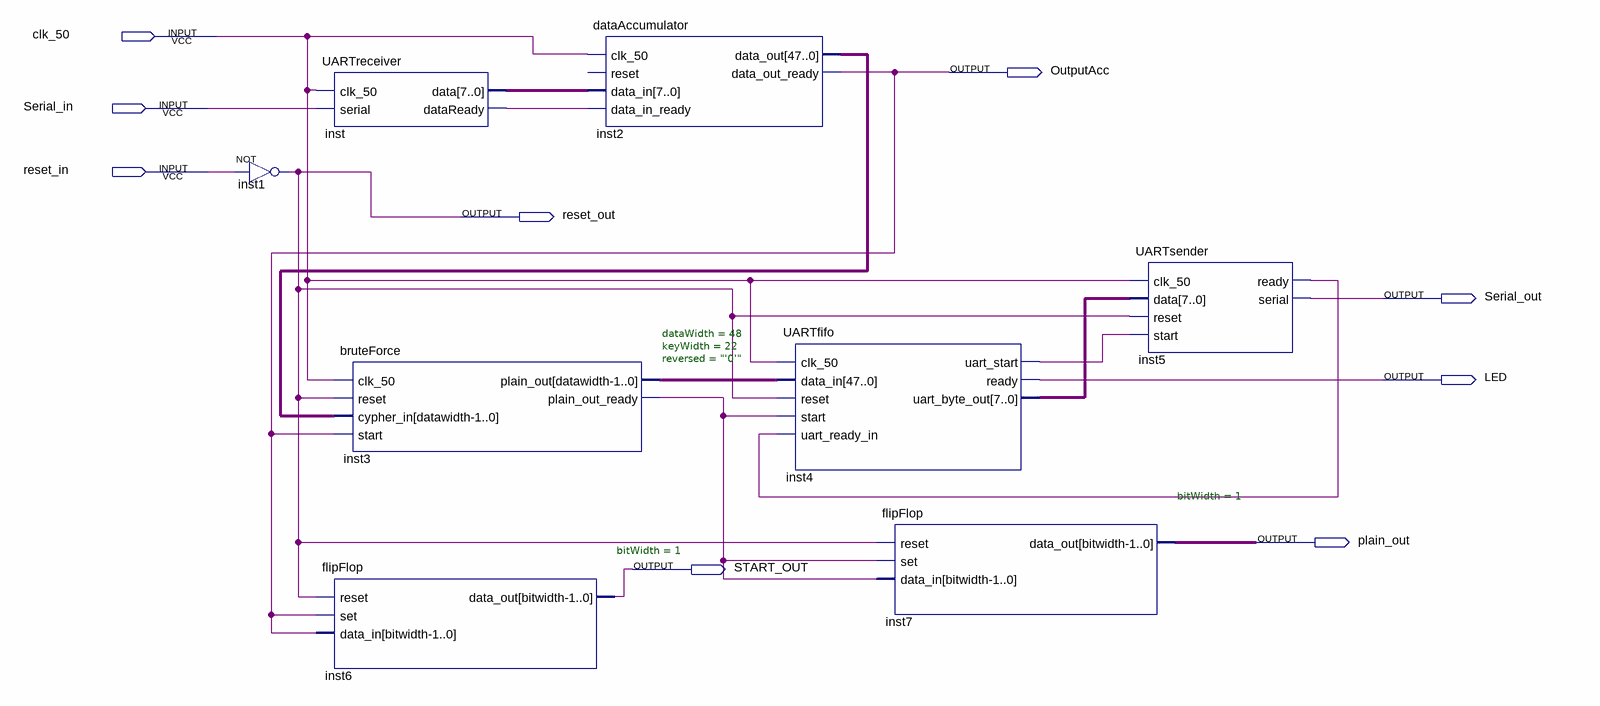
[diagram p0: schematic sheet]
// Quartus schematic bruteForceAttack.bdf as structural Verilog: 8 symbols, 9 pins
module bruteForceAttack (
  input  clk_50,
  input  Serial_in,
  input  reset_in,
  output OutputAcc,
  output reset_out,
  output Serial_out,
  output LED,
  output plain_out,
  output START_OUT
);

  wire inst3_plain_out_ready, inst4_uart_start, inst5_ready, inst_dataready;
  wire [7:0] inst4_uart_byte_out, inst_data;
  wire [47:0] inst2_data_out, inst3_plain_out;

  not inst1 (reset_out, reset_in);
  UARTreceiver inst (.clk_50(clk_50), .serial(Serial_in), .data(inst_data), .dataReady(inst_dataready));
  bruteForce #(.dataWidth(48), .keyWidth(22), .reversed("'0'")) inst3 (
    .clk_50(clk_50), .reset(reset_out), .cypher_in(inst2_data_out), .start(OutputAcc),
    .plain_out(inst3_plain_out), .plain_out_ready(inst3_plain_out_ready));
  flipFlop #(.bitWidth(1)) inst6 (.reset(reset_out), .set(OutputAcc), .data_in(OutputAcc), .data_out(START_OUT));
  dataAccumulator inst2 (
    .clk_50(clk_50), .data_in(inst_data), .data_in_ready(inst_dataready), .data_out(inst2_data_out),
    .data_out_ready(OutputAcc));  // open: reset
  UARTfifo inst4 (
    .clk_50(clk_50), .data_in(inst3_plain_out), .reset(reset_out), .start(inst3_plain_out_ready),
    .uart_ready_in(inst5_ready), .uart_start(inst4_uart_start), .ready(LED),
    .uart_byte_out(inst4_uart_byte_out));
  flipFlop #(.bitWidth(1)) inst7 (
    .reset(reset_out), .set(inst3_plain_out_ready), .data_in(inst3_plain_out_ready), .data_out(plain_out));
  UARTsender inst5 (
    .clk_50(clk_50), .data(inst4_uart_byte_out), .reset(reset_out), .start(inst4_uart_start),
    .ready(inst5_ready), .serial(Serial_out));
endmodule
